# Altium schematic sheet 10.RK3588_VCCIO1_VCCIO3_SARADC.SchDoc
size A3; SheetNumber: 10; SheetTotal: 21
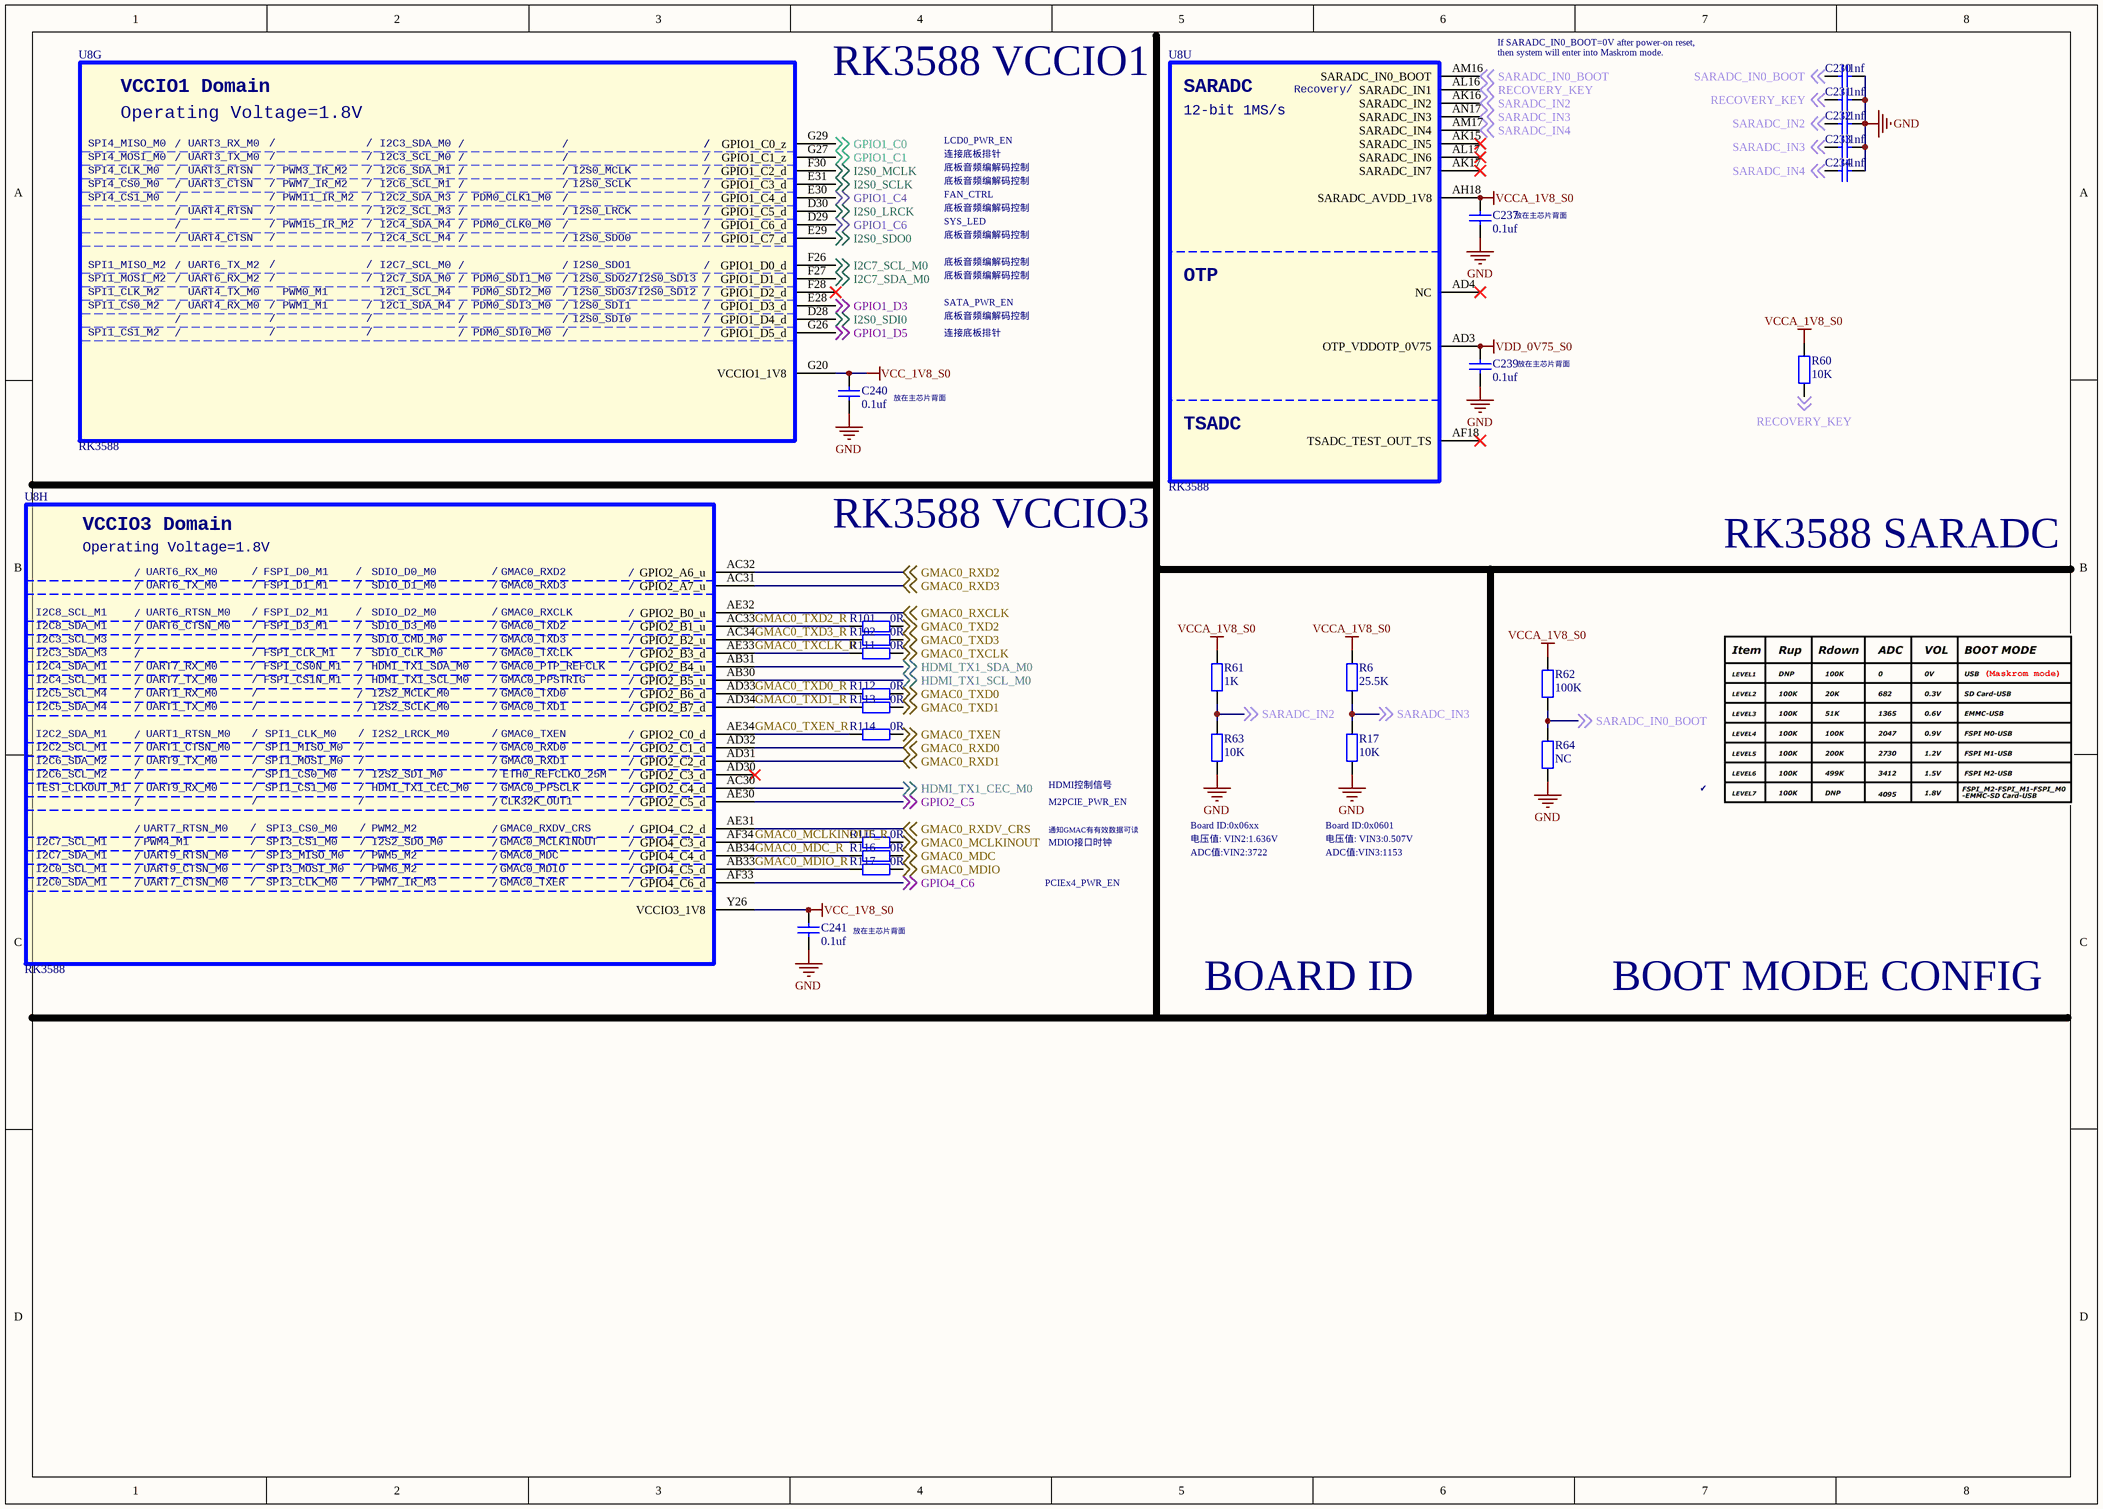
[diagram p0: 10.RK3588_VCCIO1_VCCIO3_SARADC.SchDoc]

## Parts
C230  1nf  [C0201_L]
C231  1nf  [C0201_L]
C232  1nf  [C0201_L]
C233  1nf  [C0201_L]
C234  1nf  [C0201_L]
C237  0.1uf  [C0201_L]
C239  0.1uf  [C0201_L]
C240  0.1uf  [C0201_L]
C241  0.1uf  [C0201_L]
R6  25.5K  [R0402_L]
R17  10K  [R0402_L]
R60  10K  [R0402_L]
R61  1K  [R0402_L]
R62  100K  [R0402_L]
R63  10K  [R0402_L]
R64  NC  [R0402_L]
R101  0R  [R0201_L]
R102  0R  [R0201_L]
R111  0R  [R0201_L]
R112  0R  [R0201_L]
R113  0R  [R0201_L]
R114  0R  [R0201_L]
R115  0R  [R0201_L]
R116  0R  [R0201_L]
R117  0R  [R0201_L]
U8  RK3588  [BGA1088_23R00X23R00X2R00]  (parts G,H,U of 26)

## Nets
GND: C230.2 C231.2 C232.2 C233.2 C234.2 C237.1 C239.1 C240.1 C241.1 R17.1 R63.1 R64.1
VCC_1V8_S0: C240.2 C241.2 U8.G20(VCCIO1_1V8) U8.Y26(VCCIO3_1V8)
VCCA_1V8_S0: C237.2 R6.2 R60.2 R61.2 R62.2 U8.AH18(SARADC_AVDD_1V8)
VDD_0V75_S0: C239.2 U8.AD3(OTP_VDDOTP_0V75)
GMAC0_MCLKINOUT: R115.2 ; off-sheet GMAC0_MCLKINOUT
GMAC0_MCLKINOUT_R: R115.1 U8.AF34(GPIO4_C3_d)
GMAC0_MDC: R116.2 ; off-sheet GMAC0_MDC
GMAC0_MDC_R: R116.1 U8.AB34(GPIO4_C4_d)
GMAC0_MDIO: R117.2 ; off-sheet GMAC0_MDIO
GMAC0_MDIO_R: R117.1 U8.AB33(GPIO4_C5_d)
GMAC0_RXCLK: U8.AE32(GPIO2_B0_u) ; off-sheet GMAC0_RXCLK
GMAC0_RXD0: U8.AD32(GPIO2_C1_d) ; off-sheet GMAC0_RXD0
GMAC0_RXD1: U8.AD31(GPIO2_C2_d) ; off-sheet GMAC0_RXD1
GMAC0_RXD2: U8.AC32(GPIO2_A6_u) ; off-sheet GMAC0_RXD2
GMAC0_RXD3: U8.AC31(GPIO2_A7_u) ; off-sheet GMAC0_RXD3
GMAC0_RXDV_CRS: U8.AE31(GPIO4_C2_d) ; off-sheet GMAC0_RXDV_CRS
GMAC0_TXCLK: R111.2 ; off-sheet GMAC0_TXCLK
GMAC0_TXCLK_R: R111.1 U8.AE33(GPIO2_B3_d)
GMAC0_TXD0: R112.2 ; off-sheet GMAC0_TXD0
GMAC0_TXD0_R: R112.1 U8.AD33(GPIO2_B6_d)
GMAC0_TXD1: R113.2 ; off-sheet GMAC0_TXD1
GMAC0_TXD1_R: R113.1 U8.AD34(GPIO2_B7_d)
GMAC0_TXD2: R101.2 ; off-sheet GMAC0_TXD2
GMAC0_TXD2_R: R101.1 U8.AC33(GPIO2_B1_u)
GMAC0_TXD3: R102.2 ; off-sheet GMAC0_TXD3
GMAC0_TXD3_R: R102.1 U8.AC34(GPIO2_B2_u)
GMAC0_TXEN: R114.2 ; off-sheet GMAC0_TXEN
GMAC0_TXEN_R: R114.1 U8.AE34(GPIO2_C0_d)
GPIO1_C0: U8.G29(GPIO1_C0_z) ; off-sheet GPIO1_C0
GPIO1_C1: U8.G27(GPIO1_C1_z) ; off-sheet GPIO1_C1
GPIO1_C4: U8.E30(GPIO1_C4_d) ; off-sheet GPIO1_C4
GPIO1_C6: U8.D29(GPIO1_C6_d) ; off-sheet GPIO1_C6
GPIO1_D3: U8.E28(GPIO1_D3_d) ; off-sheet GPIO1_D3
GPIO1_D5: U8.G26(GPIO1_D5_d) ; off-sheet GPIO1_D5
GPIO2_C5: U8.AE30(GPIO2_C5_d) ; off-sheet GPIO2_C5
GPIO4_C6: U8.AF33(GPIO4_C6_d) ; off-sheet GPIO4_C6
HDMI_TX1_CEC_M0: U8.AC30(GPIO2_C4_d) ; off-sheet HDMI_TX1_CEC_M0
HDMI_TX1_SCL_M0: U8.AB30(GPIO2_B5_u) ; off-sheet HDMI_TX1_SCL_M0
HDMI_TX1_SDA_M0: U8.AB31(GPIO2_B4_u) ; off-sheet HDMI_TX1_SDA_M0
I2C7_SCL_M0: U8.F26(GPIO1_D0_d) ; off-sheet I2C7_SCL_M0
I2C7_SDA_M0: U8.F27(GPIO1_D1_d) ; off-sheet I2C7_SDA_M0
I2S0_LRCK: U8.D30(GPIO1_C5_d) ; off-sheet I2S0_LRCK
I2S0_MCLK: U8.F30(GPIO1_C2_d) ; off-sheet I2S0_MCLK
I2S0_SCLK: U8.E31(GPIO1_C3_d) ; off-sheet I2S0_SCLK
I2S0_SDI0: U8.D28(GPIO1_D4_d) ; off-sheet I2S0_SDI0
I2S0_SDO0: U8.E29(GPIO1_C7_d) ; off-sheet I2S0_SDO0
RECOVERY_KEY: C231.1 R60.1 U8.AL16(SARADC_IN1) ; off-sheet RECOVERY_KEY
SARADC_IN0_BOOT: C230.1 R62.1 R64.2 U8.AM16(SARADC_IN0_BOOT) ; off-sheet SARADC_IN0_BOOT
SARADC_IN2: C232.1 R61.1 R63.2 U8.AK16(SARADC_IN2) ; off-sheet SARADC_IN2
SARADC_IN3: C233.1 R6.1 R17.2 U8.AN17(SARADC_IN3) ; off-sheet SARADC_IN3
SARADC_IN4: C234.1 U8.AM17(SARADC_IN4) ; off-sheet SARADC_IN4

Not connected (* = marked no-connect by the designer): U8 AD4(NC)* AD30(GPIO2_C3_d)* AF18(TSADC_TEST_OUT_TS)* AK15(SARADC_IN5)* AK17(SARADC_IN7)* AL17(SARADC_IN6)* F28(GPIO1_D2_d)*

## Notes on the sheet
- If SARADC_IN0_BOOT=0V after power-on reset,
- RK3588 VCCIO1
- then system will enter into Maskrom mode.
- LCD0_PWR_EN
- 底板音频编解码控制
- 连接底板排针
- FAN_CTRL
- SYS_LED
- (near C237) 放在主芯片背面
- SATA_PWR_EN
- (near C239) 放在主芯片背面
- (near C240) 放在主芯片背面
- RK3588 VCCIO3
- RK3588 SARADC
- HDMI控制信号
- 通知GMAC有有效数据可读
- MDIO接口时钟
- M2PCIE_PWR_EN
- Board ID:0x06xx
- 电压值: VIN2:1.636V
- ADC值:VIN2:3722
- Board ID:0x0601
- 电压值: VIN3:0.507V
- ADC值:VIN3:1153
- ✔
- PCIEx4_PWR_EN
- 放在主芯片背面
- BOARD ID
- BOOT MODE CONFIG
- (in symbol SOC_RK3588, part G) VCCIO1 Domain; Operating Voltage=1.8V; SPI4_MISO_M0; /; UART3_RX_M0; I2C3_SDA_M0; SPI4_MOSI_M0; UART3_TX_M0; I2C3_SCL_M0; SPI4_CLK_M0; UART3_RTSN; PWM3_IR_M2; I2C6_SDA_M1; I2S0_MCLK; SPI4_CS0_M0; UART3_CTSN; PWM7_IR_M2; I2C6_SCL_M1; I2S0_SCLK; SPI4_CS1_M0; PWM11_IR_M2; I2C2_SDA_M3; PDM0_CLK1_M0; UART4_RTSN; I2C2_SCL_M3; I2S0_LRCK; PWM15_IR_M2; I2C4_SDA_M4; PDM0_CLK0_M0; UART4_CTSN; I2C4_SCL_M4; I2S0_SDO0; SPI1_MISO_M2; UART6_TX_M2; I2C7_SCL_M0; I2S0_SDO1; SPI1_MOSI_M2; UART6_RX_M2; I2C7_SDA_M0; PDM0_SDI1_M0; I2S0_SDO2/I2S0_SDI3; SPI1_CLK_M2; UART4_TX_M0; PWM0_M1; I2C1_SCL_M4; PDM0_SDI2_M0; I2S0_SDO3/I2S0_SDI2; SPI1_CS0_M2; UART4_RX_M0; PWM1_M1; I2C1_SDA_M4; PDM0_SDI3_M0; I2S0_SDI1; I2S0_SDI0; SPI1_CS1_M2; PDM0_SDI0_M0
- (in symbol SOC_RK3588, part H) VCCIO3 Domain; Operating Voltage=1.8V; /; UART6_RX_M0; FSPI_D0_M1; SDIO_D0_M0; GMAC0_RXD2; UART6_TX_M0; FSPI_D1_M1; SDIO_D1_M0; GMAC0_RXD3; I2C8_SCL_M1; UART6_RTSN_M0; FSPI_D2_M1; SDIO_D2_M0; GMAC0_RXCLK; I2C8_SDA_M1; UART6_CTSN_M0; FSPI_D3_M1; SDIO_D3_M0; GMAC0_TXD2; I2C3_SCL_M3; SDIO_CMD_M0; GMAC0_TXD3; I2C3_SDA_M3; FSPI_CLK_M1; SDIO_CLK_M0; GMAC0_TXCLK; I2C4_SDA_M1; UART7_RX_M0; FSPI_CS0N_M1; HDMI_TX1_SDA_M0; GMAC0_PTP_REFCLK; I2C4_SCL_M1; UART7_TX_M0; FSPI_CS1N_M1; HDMI_TX1_SCL_M0; GMAC0_PPSTRIG; I2C5_SCL_M4; UART1_RX_M0; I2S2_MCLK_M0; GMAC0_TXD0; I2C5_SDA_M4; UART1_TX_M0; I2S2_SCLK_M0; GMAC0_TXD1; I2C2_SDA_M1; UART1_RTSN_M0; SPI1_CLK_M0; I2S2_LRCK_M0; GMAC0_TXEN; I2C2_SCL_M1; UART1_CTSN_M0; SPI1_MISO_M0; GMAC0_RXD0; I2C6_SDA_M2; UART9_TX_M0; SPI1_MOSI_M0; GMAC0_RXD1; I2C6_SCL_M2; SPI1_CS0_M0; I2S2_SDI_M0; ETH0_REFCLKO_25M; TEST_CLKOUT_M1; UART9_RX_M0; SPI1_CS1_M0; HDMI_TX1_CEC_M0; GMAC0_PPSCLK; CLK32K_OUT1; UART7_RTSN_M0; SPI3_CS0_M0; PWM2_M2; GMAC0_RXDV_CRS; I2C7_SCL_M1; PWM4_M1; SPI3_CS1_M0; I2S2_SDO_M0; GMAC0_MCLKINOUT; I2C7_SDA_M1; UART9_RTSN_M0; SPI3_MISO_M0; PWM5_M2; GMAC0_MDC; I2C0_SCL_M1; UART9_CTSN_M0; SPI3_MOSI_M0; PWM6_M2; GMAC0_MDIO; I2C0_SDA_M1; UART7_CTSN_M0; SPI3_CLK_M0; PWM7_IR_M3; GMAC0_TXER
- (in symbol SOC_RK3588, part U) SARADC; Recovery/; 12-bit 1MS/s; OTP; TSADC

## Library data of the parts
C230-C234 C237 C239-C241 = C: 贴片电容/MLCC电容
R6 R17 R60-R64 R101 R102 R111-R117 = R: 贴片电阻
U8 = SOC_RK3588: ROCKCHIP SOC